# Altium project Keyboard2025.PrjPcb
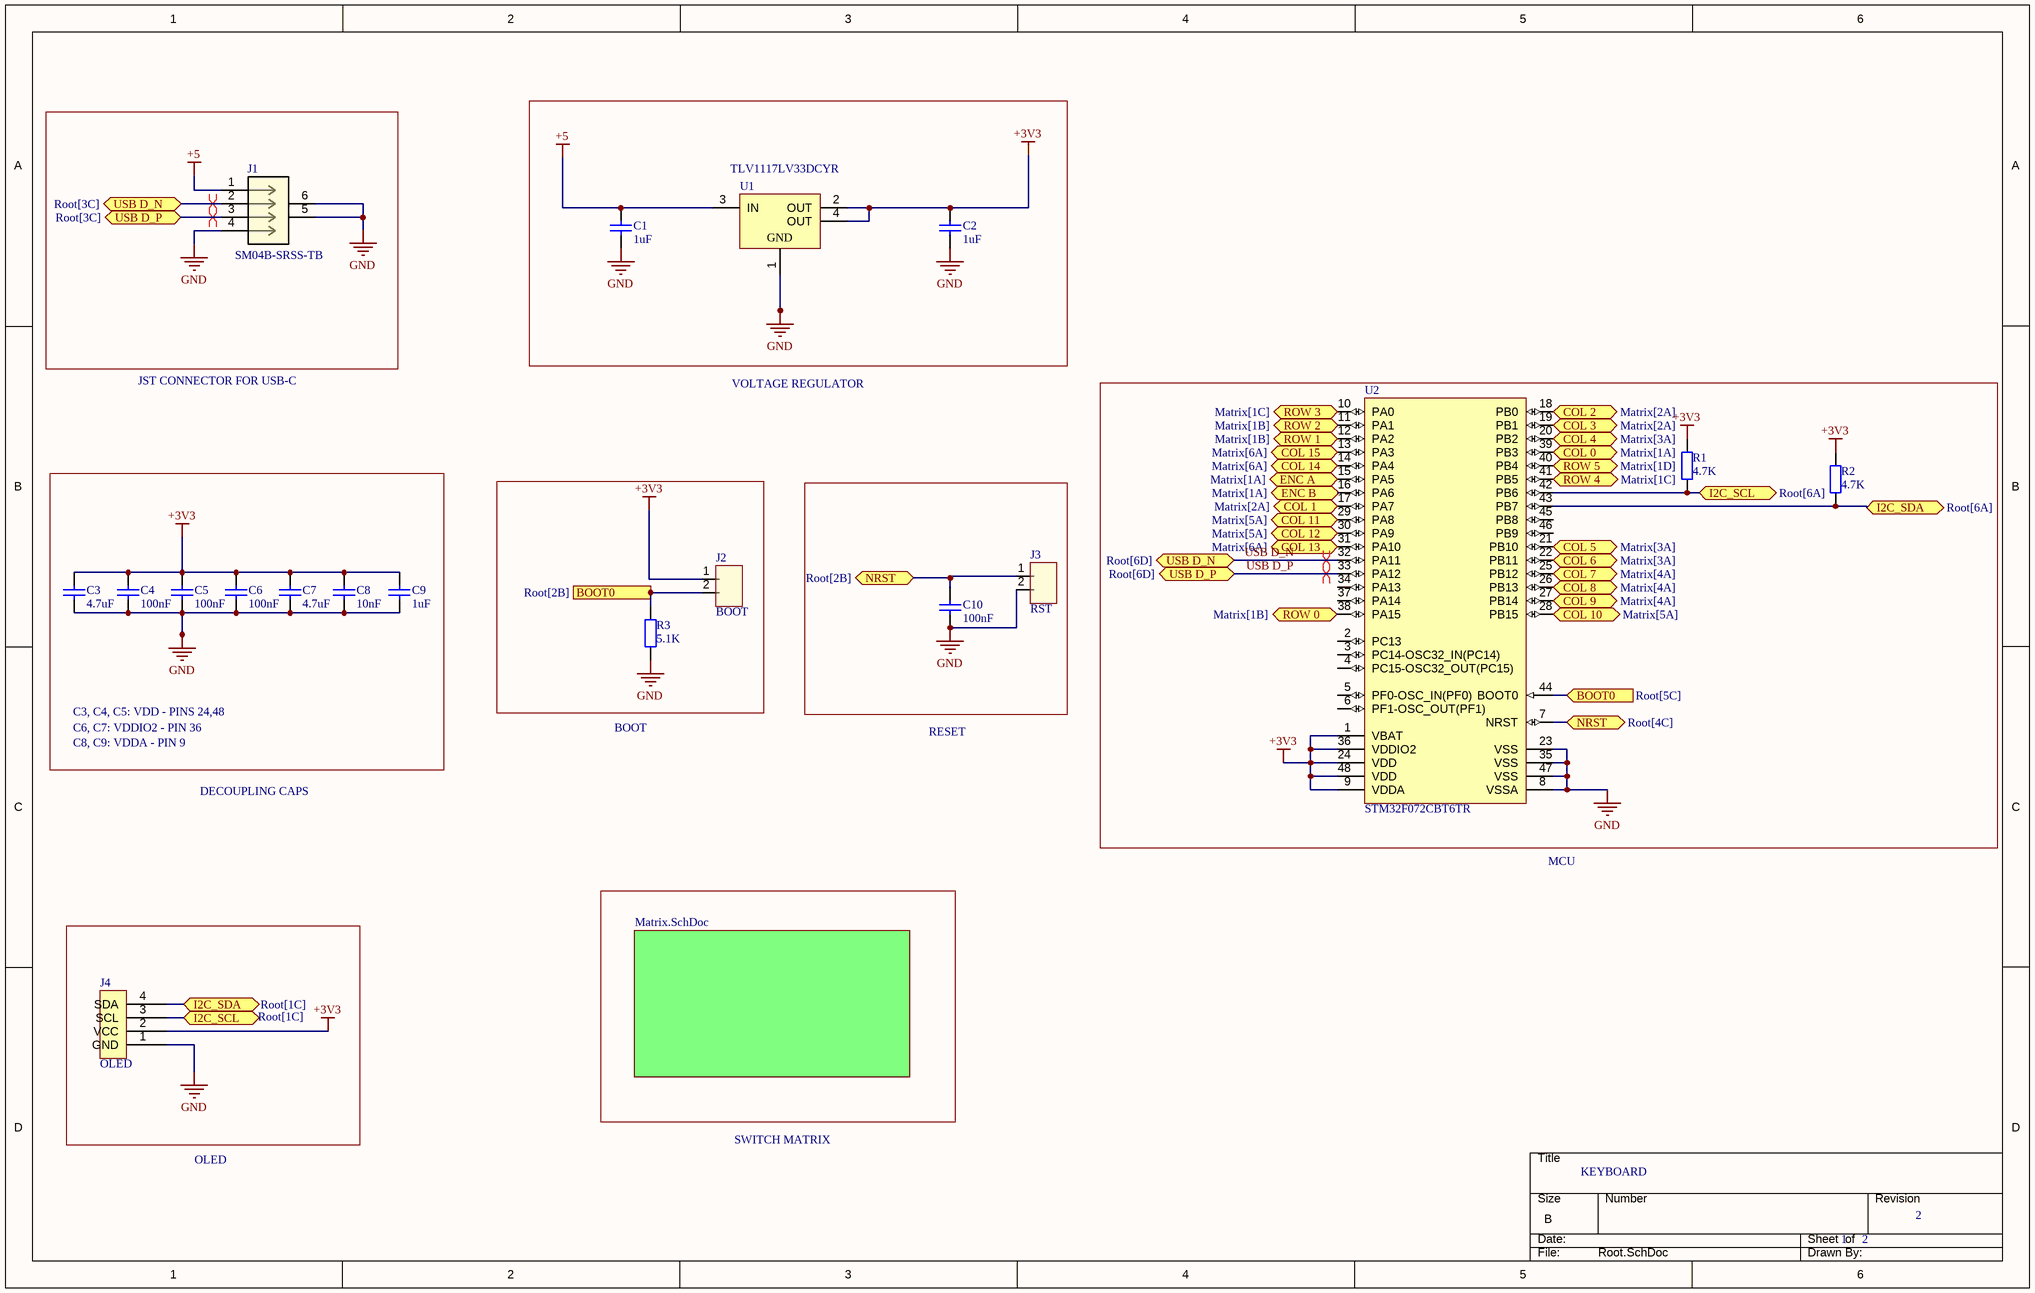
[diagram p0: Root.SchDoc]
2 sheets, 191 parts. Net scope: flat (ports and power ports of the same name join across sheets).
Board file: pcb.PcbDoc
Sheets:
  Root.SchDoc
    Matrix = Matrix.SchDoc

## Sheet Root.SchDoc
size B; SheetNumber: 1; SheetTotal: 2; SPICEModelCacheRYIKSWGO: <root> / <DocumentId>RYIKSWGO</DocumentId> / </root>

### Parts
C1  value 1uF  [C0805]  (hidden comment: Cap)
C2  value 1uF  [C0805]  (hidden comment: Cap)
C3  value 4.7uF  [C0805]  (hidden comment: Cap)
C4  value 100nF  [C0805]  (hidden comment: Cap)
C5  value 100nF  [C0805]  (hidden comment: Cap)
C6  value 100nF  [C0805]  (hidden comment: Cap)
C7  value 4.7uF  [C0805]  (hidden comment: Cap)
C8  value 10nF  [C0805]  (hidden comment: Cap)
C9  value 1uF  [C0805]  (hidden comment: Cap)
C10  value 100nF  [C0805]  (hidden comment: Cap)
J1  SM04B-SRSS-TB  [JST-SR-4]
J2  BOOT  [HDR_1X2]
J3  RST  [HDR_1X2]
J4  OLED  [SSD1306-0.91-OLED-4pin-128x32]
R1  value 4.7K  [6-0805_M]  (hidden comment: Res2)
R2  value 4.7K  [6-0805_M]  (hidden comment: Res2)
R3  value 5.1K  [6-0805_M]  (hidden comment: Res2)
U1  TLV1117LV33DCYR  [DCY0004A_M]
U2  STM32F072CBT6TR  [STM-LQFP48_M]

### Sub-sheets
Matrix = Matrix.SchDoc: no entries

### Ports
BOOT0 (in, see Root[5C]), BOOT0 (out, see Root[2B]), COL 0 (bidir, see Matrix[1A]), COL 1 (bidir, see Matrix[2A]), COL 2 (bidir, see Matrix[2A]), COL 3 (bidir, see Matrix[2A]), COL 4 (bidir, see Matrix[3A]), COL 5 (bidir, see Matrix[3A]), COL 6 (bidir, see Matrix[3A]), COL 7 (bidir, see Matrix[4A]), COL 8 (bidir, see Matrix[4A]), COL 9 (bidir, see Matrix[4A]), COL 10 (bidir, see Matrix[5A]), COL 11 (bidir, see Matrix[5A]), COL 12 (bidir, see Matrix[5A]), COL 13 (bidir, see Matrix[6A]), COL 14 (bidir, see Matrix[6A]), COL 15 (bidir, see Matrix[6A]), ENC A (bidir, see Matrix[1A]), ENC B (bidir, see Matrix[1A]), I2C_SCL (bidir, see Root[1C]), I2C_SCL (bidir, see Root[6A]), I2C_SDA (bidir, see Root[1C]), I2C_SDA (bidir, see Root[6A]), NRST (bidir, see Root[2B]), NRST (bidir, see Root[4C]), ROW 0 (bidir, see Matrix[1B]), ROW 1 (bidir, see Matrix[1B]), ROW 2 (bidir, see Matrix[1B]), ROW 3 (bidir, see Matrix[1C]), ROW 4 (bidir, see Matrix[1C]), ROW 5 (bidir, see Matrix[1D]), USB D_N (bidir, see Root[3C]), USB D_N (bidir, see Root[6D]), USB D_P (bidir, see Root[3C]), USB D_P (bidir, see Root[6D])

### Nets
+3V3: C2.2 C3.2 C4.2 C5.2 C6.2 C7.2 C8.2 C9.2 J2.1 J4.2(VCC) R1.2 R2.2 U1.2(OUT) U1.4(OUT) U2.1(VBAT) U2.9(VDDA) U2.24(VDD) U2.36(VDDIO2) U2.48(VDD)
+5: C1.2 J1.1 U1.3(IN)
GND: C1.1 C2.1 C3.1 C4.1 C5.1 C6.1 C7.1 C8.1 C9.1 C10.1 J1.4 J1.5(MOUNT) J1.6(MOUNT) J3.2 J4.1(GND) R3.1 U1.1(GND) U2.8(VSSA) U2.23(VSS) U2.35(VSS) U2.47(VSS)
USB D_N: J1.2 U2.32(PA11) ; port USB D_N
USB D_P: J1.3 U2.33(PA12) ; port USB D_P
NetC10_2: C10.2 J3.1 U2.7(NRST) ; port NRST
NetD1_2: U2.38(PA15) ; port ROW 0
NetD14_2: U2.12(PA2) ; port ROW 1
NetD30_2: U2.11(PA1) ; port ROW 2
NetD46_2: U2.10(PA0) ; port ROW 3
NetD61_2: U2.41(PB5) ; port ROW 4
NetD76_2: U2.40(PB4) ; port ROW 5
NetJ2_2: J2.2 R3.2 U2.44(BOOT0) ; port BOOT0
NetJ4_3: J4.3(SCL) R1.1 U2.42(PB6) ; port I2C_SCL
NetJ4_4: J4.4(SDA) R2.1 U2.43(PB7) ; port I2C_SDA
NetMX1_1: U2.17(PA7) ; port COL 1
NetMX2_1: U2.18(PB0) ; port COL 2
NetMX3_1: U2.19(PB1) ; port COL 3
NetMX4_1: U2.20(PB2) ; port COL 4
NetMX5_1: U2.21(PB10) ; port COL 5
NetMX6_1: U2.22(PB11) ; port COL 6
NetMX7_1: U2.25(PB12) ; port COL 7
NetMX8_1: U2.26(PB13) ; port COL 8
NetMX9_1: U2.27(PB14) ; port COL 9
NetMX10_1: U2.28(PB15) ; port COL 10
NetMX11_1: U2.29(PA8) ; port COL 11
NetMX12_1: U2.30(PA9) ; port COL 12
NetMX13_1: U2.31(PA10) ; port COL 13
NetMX14_1: U2.39(PB3) ; port COL 0
NetMX28_1: U2.14(PA4) ; port COL 14
NetMX29_1: U2.13(PA3) ; port COL 15
NetSW1_A: U2.15(PA5) ; port ENC A
NetSW1_B: U2.16(PA6) ; port ENC B

Not connected (* = marked no-connect by the designer): U2 2(PC13) 3(PC14-OSC32_IN(PC14)) 4(PC15-OSC32_OUT(PC15)) 5(PF0-OSC_IN(PF0)) 6(PF1-OSC_OUT(PF1)) 34(PA13) 37(PA14) 45(PB8) 46(PB9)

### Layout directives
differential pair: USB D_N, USB D_P

### Notes on the sheet
- JST CONNECTOR FOR USB-C
- VOLTAGE REGULATOR
- C3, C4, C5: VDD - PINS 24,48
- C6, C7: VDDIO2 - PIN 36
- C8, C9: VDDA - PIN 9
- BOOT
- RESET
- DECOUPLING CAPS
- MCU
- OLED
- SWITCH MATRIX
- KEYBOARD
- 1     2
- 2
- DWG. NO.
- REV.
- SHT.
- REVISION
- DESCRIPTION
- DATE
- APPROVED
- THIS DOCUMENT AND THE DATA DISCLOSED HEREIN OR HEREWITH IS THE PROPERTY OF ALTIUM LIMITED AND MAY BE FREELY DISTRIBUTED IN WHOLE. NO RIGHTS ARE RESERVED OR EXPRESS OR IMPLIED WARANTEE GIVEN.
- ENG:
- DSN:
- APPROVALS
- PROJECT
- DOCUMENT REVISION:
- DESIGN ITEM:
- CHK:
- BOM:
- REFERENCE DOCUMENTS
- PROJECT REVISION:
- TITLE
- FAB DWG:
- PCB DWG:
- ASSY DWG:
- SCALE:
- SIZE
- C
- CAGE CODE
- FILE NAME
- DWG NO.
- SHEET
- OF
- REV

### Library data of the parts
C1-C10 = Cap: Capacitor; Published: 8-Jun-2000; LatestRevisionDate: 17-Jul-2002; LatestRevisionNote: Re-released for DXP Platform.; PackageReference: RAD-0.3; Publisher: Altium Limited; PackageDescription: Radial Cap, Thru-Hole; 2 Leads; 0.3 in Pin Spacing
J1 = SM04B-SRSS-TB: No Description Available; Mfr_Name: JST; RefDes: RefDes; Type: Type
J2 J3 = CMP-002-00110-3: VALUE: HDRM2; Pins: 2; Design Item ID: HDR_1X2; Component Type: Standard; Source: Conn Header.SchLib
J4 = CMP-002-00072-5: 4 pin header
R1-R3 = Res2: Resistor; Published: 8-Jun-2000; LatestRevisionDate: 17-Jul-2002; LatestRevisionNote: Re-released for DXP Platform.; PackageReference: AXIAL-0.4; Publisher: Altium Limited; PackageDescription: Axial Device, Thru-Hole; 2 Leads; 0.4 in Pin Spacing
U1 = CMP-0395-00503-2: Single Output LDO, 1 A, Fixed 3.3 V Output, 2 to 5.5 V Input, 4-pin SOT-223 (DCY), -40 to 125 degC, Green (RoHS & no Sb/Br); Manufacturer: Texas Instruments; Vout Adj(Min)(V): 3.3; Vdo(Typ)(mV): 1200; Iq(Typ)(mA): 0.05; Accuracy(%): 2; Iout(Max)(A): 1; SubFamily: Single Channel LDO; Vin(Max)(V): 5.5; PackageReference: DCY0004A; PackageDescription: 4-Pin Plastic Small Outline, Body 3.5 x 6.5 mm, Pitch 2.3 mm; Vout Adj(Max)(V): 3.3; Mounting Technology: Surface Mount; ComponentLink2Description: Datasheet; ComponentLink1Description: Manufacturer URL; PartNumber: TLV1117LV33DCYR; ComponentLink3Description: Package Specification; ComponentLink1URL: http://www.ti.com/; ComponentLink2URL: http://www.ti.com/general/docs/lit/getliterature.tsp?genericPartNumber=TLV1117LV33&fileType=pdf; Fixed Output Options(V): 3.3; PackageVersion: 4202506/B; Vin(Min)(V): 2; DatasheetVersion: SBVS160A; Eco-Plan: Green (RoHS & no Sb/Br); ComponentLink3URL: http://www.ti.com/litv/pdf/mpds094a; Code_JEDEC: TO-261
U2 = CMP-0304-00171-1: ARM Cortex-M0 32-bit MCU, 128 KB Flash, 16 KB Internal RAM, 37 I/Os, 48-Pin LQFP, -40 to 85 degC, Tape and Reel; FLASH Size (Prog) (kB): 128; D/A Converter: 1; Operating Frequency(F) (Processor speed) (MHz): 48; Supply Voltage(Vcc) min (V): 2; I/Os (High Current): 37; Internal RAM Size (kB): 16; ComponentLink1URL: http://www.st.com/; DatasheetVersion: Rev. 5; Mounting Technology: Surface Mount; Packing: Tape and Reel; ComponentLink2Description: Datasheet; ComponentLink2URL: http://www.st.com/st-web-ui/static/active/en/resource/technical/document/datasheet/DM00090510.pdf; ComponentLink1Description: Manufacturer URL; Package Reference: LQFP48; Core: ARM Cortex-M0; Package Description: 48-Pin Low Profile Quad Flat Package, Body 7 x 7 mm, Pitch 0.5 mm

## Sheet Matrix.SchDoc
size B; SheetNumber: 2; SheetTotal: 2
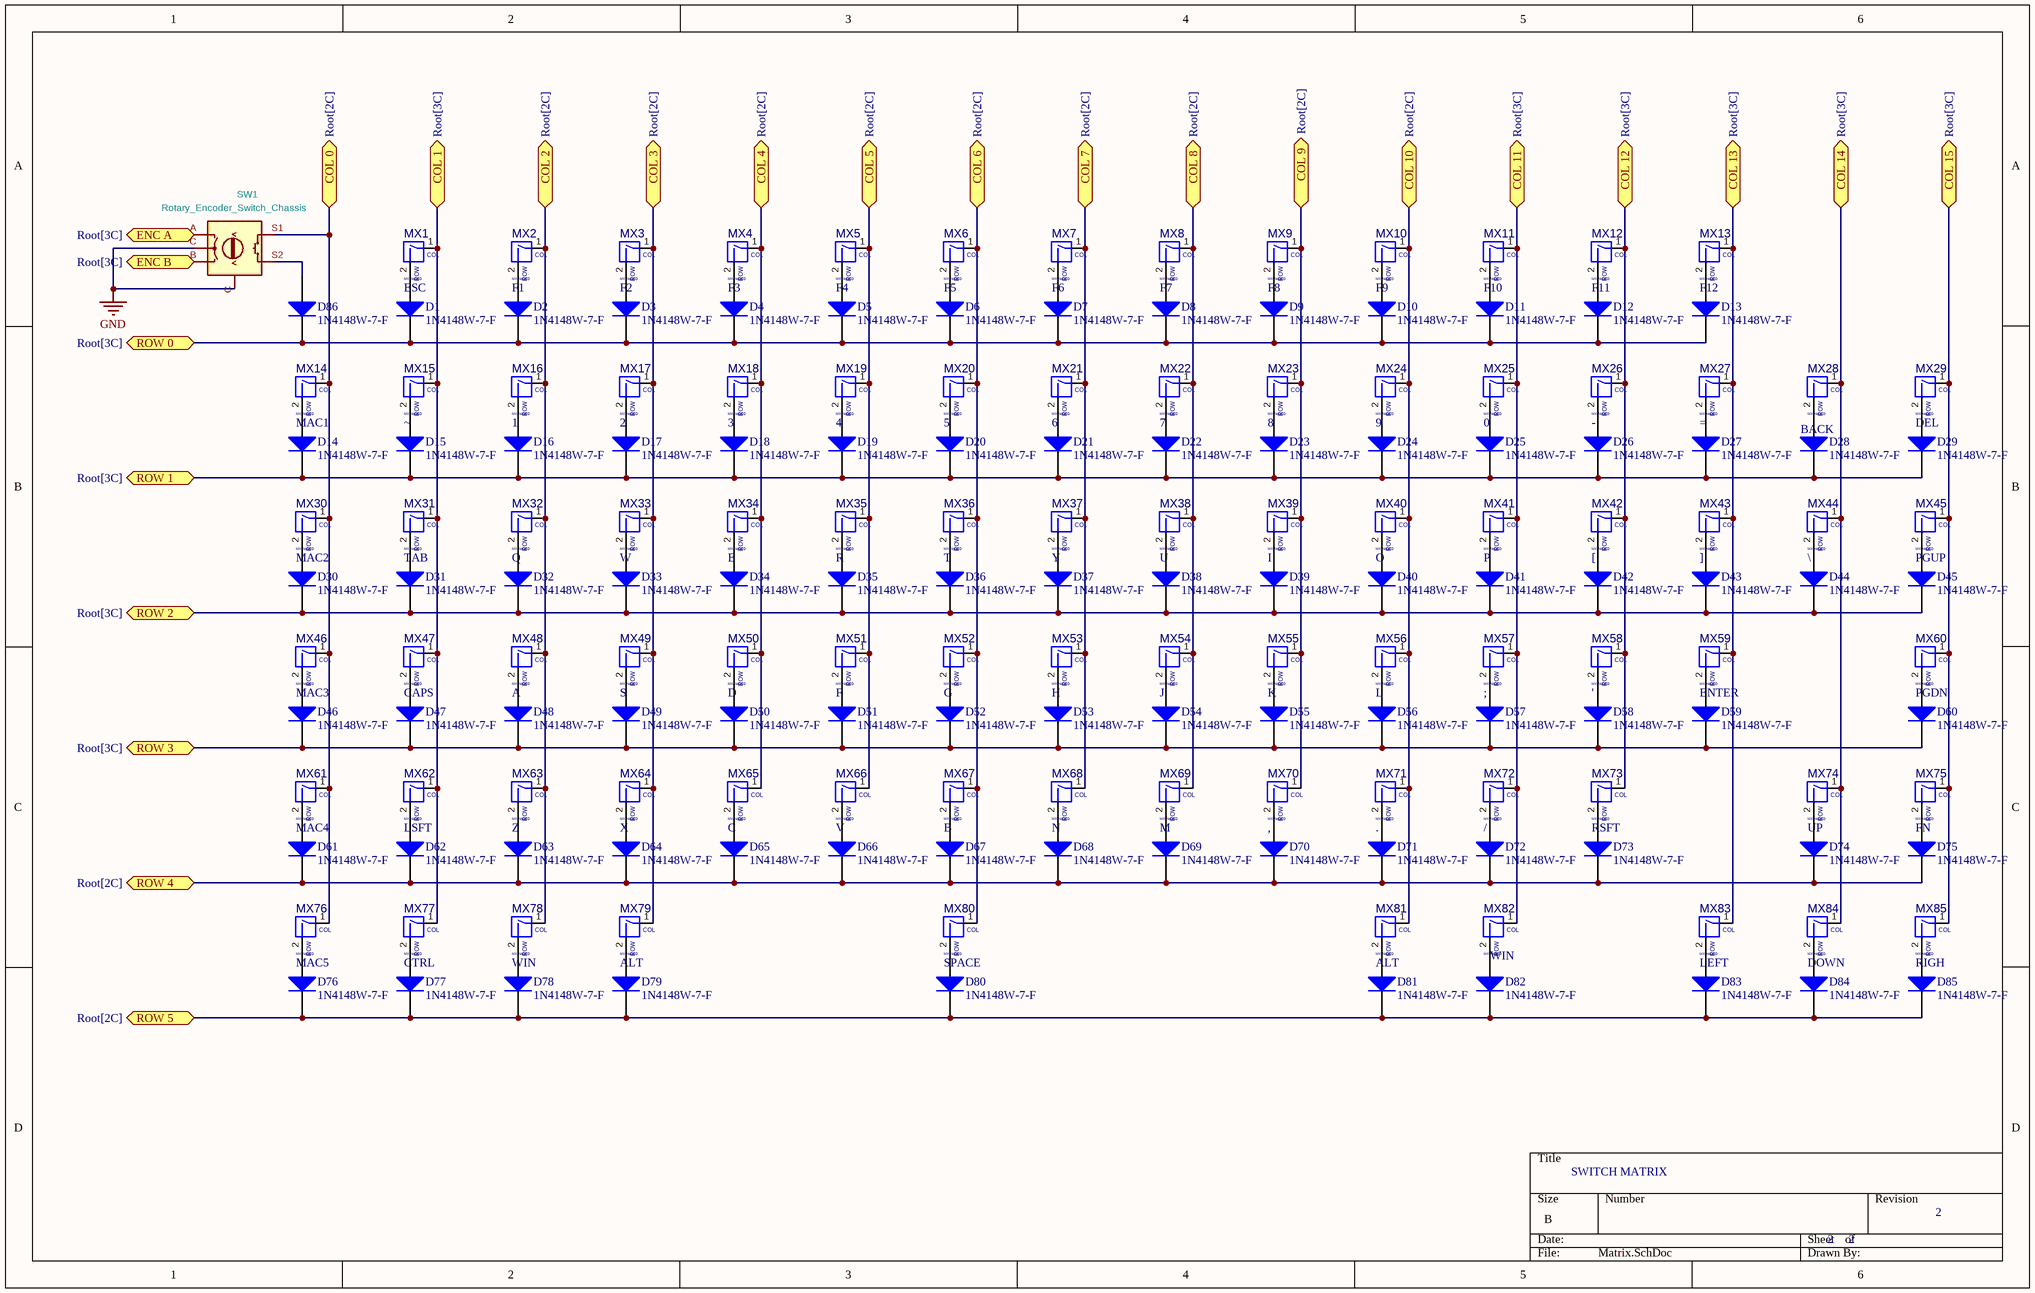
[diagram p1: Matrix.SchDoc]

### Parts
D1  1N4148W-7-F  [DIOD-SOD123-2_V]
D2  1N4148W-7-F  [DIOD-SOD123-2_V]
D3  1N4148W-7-F  [DIOD-SOD123-2_V]
D4  1N4148W-7-F  [DIOD-SOD123-2_V]
D5  1N4148W-7-F  [DIOD-SOD123-2_V]
D6  1N4148W-7-F  [DIOD-SOD123-2_V]
D7  1N4148W-7-F  [DIOD-SOD123-2_V]
D8  1N4148W-7-F  [DIOD-SOD123-2_V]
D9  1N4148W-7-F  [DIOD-SOD123-2_V]
D10  1N4148W-7-F  [DIOD-SOD123-2_V]
D11  1N4148W-7-F  [DIOD-SOD123-2_V]
D12  1N4148W-7-F  [DIOD-SOD123-2_V]
D13  1N4148W-7-F  [DIOD-SOD123-2_V]
D14  1N4148W-7-F  [DIOD-SOD123-2_V]
D15  1N4148W-7-F  [DIOD-SOD123-2_V]
D16  1N4148W-7-F  [DIOD-SOD123-2_V]
D17  1N4148W-7-F  [DIOD-SOD123-2_V]
D18  1N4148W-7-F  [DIOD-SOD123-2_V]
D19  1N4148W-7-F  [DIOD-SOD123-2_V]
D20  1N4148W-7-F  [DIOD-SOD123-2_V]
D21  1N4148W-7-F  [DIOD-SOD123-2_V]
D22  1N4148W-7-F  [DIOD-SOD123-2_V]
D23  1N4148W-7-F  [DIOD-SOD123-2_V]
D24  1N4148W-7-F  [DIOD-SOD123-2_V]
D25  1N4148W-7-F  [DIOD-SOD123-2_V]
D26  1N4148W-7-F  [DIOD-SOD123-2_V]
D27  1N4148W-7-F  [DIOD-SOD123-2_V]
D28  1N4148W-7-F  [DIOD-SOD123-2_V]
D29  1N4148W-7-F  [DIOD-SOD123-2_V]
D30  1N4148W-7-F  [DIOD-SOD123-2_V]
D31  1N4148W-7-F  [DIOD-SOD123-2_V]
D32  1N4148W-7-F  [DIOD-SOD123-2_V]
D33  1N4148W-7-F  [DIOD-SOD123-2_V]
D34  1N4148W-7-F  [DIOD-SOD123-2_V]
D35  1N4148W-7-F  [DIOD-SOD123-2_V]
D36  1N4148W-7-F  [DIOD-SOD123-2_V]
D37  1N4148W-7-F  [DIOD-SOD123-2_V]
D38  1N4148W-7-F  [DIOD-SOD123-2_V]
D39  1N4148W-7-F  [DIOD-SOD123-2_V]
D40  1N4148W-7-F  [DIOD-SOD123-2_V]
D41  1N4148W-7-F  [DIOD-SOD123-2_V]
D42  1N4148W-7-F  [DIOD-SOD123-2_V]
D43  1N4148W-7-F  [DIOD-SOD123-2_V]
D44  1N4148W-7-F  [DIOD-SOD123-2_V]
D45  1N4148W-7-F  [DIOD-SOD123-2_V]
D46  1N4148W-7-F  [DIOD-SOD123-2_V]
D47  1N4148W-7-F  [DIOD-SOD123-2_V]
D48  1N4148W-7-F  [DIOD-SOD123-2_V]
D49  1N4148W-7-F  [DIOD-SOD123-2_V]
D50  1N4148W-7-F  [DIOD-SOD123-2_V]
D51  1N4148W-7-F  [DIOD-SOD123-2_V]
D52  1N4148W-7-F  [DIOD-SOD123-2_V]
D53  1N4148W-7-F  [DIOD-SOD123-2_V]
D54  1N4148W-7-F  [DIOD-SOD123-2_V]
D55  1N4148W-7-F  [DIOD-SOD123-2_V]
D56  1N4148W-7-F  [DIOD-SOD123-2_V]
D57  1N4148W-7-F  [DIOD-SOD123-2_V]
D58  1N4148W-7-F  [DIOD-SOD123-2_V]
D59  1N4148W-7-F  [DIOD-SOD123-2_V]
D60  1N4148W-7-F  [DIOD-SOD123-2_V]
D61  1N4148W-7-F  [DIOD-SOD123-2_V]
D62  1N4148W-7-F  [DIOD-SOD123-2_V]
D63  1N4148W-7-F  [DIOD-SOD123-2_V]
D64  1N4148W-7-F  [DIOD-SOD123-2_V]
D65  1N4148W-7-F  [DIOD-SOD123-2_V]
D66  1N4148W-7-F  [DIOD-SOD123-2_V]
D67  1N4148W-7-F  [DIOD-SOD123-2_V]
D68  1N4148W-7-F  [DIOD-SOD123-2_V]
D69  1N4148W-7-F  [DIOD-SOD123-2_V]
D70  1N4148W-7-F  [DIOD-SOD123-2_V]
D71  1N4148W-7-F  [DIOD-SOD123-2_V]
D72  1N4148W-7-F  [DIOD-SOD123-2_V]
D73  1N4148W-7-F  [DIOD-SOD123-2_V]
D74  1N4148W-7-F  [DIOD-SOD123-2_V]
D75  1N4148W-7-F  [DIOD-SOD123-2_V]
D76  1N4148W-7-F  [DIOD-SOD123-2_V]
D77  1N4148W-7-F  [DIOD-SOD123-2_V]
D78  1N4148W-7-F  [DIOD-SOD123-2_V]
D79  1N4148W-7-F  [DIOD-SOD123-2_V]
D80  1N4148W-7-F  [DIOD-SOD123-2_V]
D81  1N4148W-7-F  [DIOD-SOD123-2_V]
D82  1N4148W-7-F  [DIOD-SOD123-2_V]
D83  1N4148W-7-F  [DIOD-SOD123-2_V]
D84  1N4148W-7-F  [DIOD-SOD123-2_V]
D85  1N4148W-7-F  [DIOD-SOD123-2_V]
D86  1N4148W-7-F  [DIOD-SOD123-2_V]
MX1  ESC  value MX-NoLED  [MXOnly-1U - duplicate]
MX2  F1  value MX-NoLED  [MXOnly-1U - duplicate]
MX3  F2  value MX-NoLED  [MXOnly-1U - duplicate]
MX4  F3  value MX-NoLED  [MXOnly-1U - duplicate]
MX5  F4  value MX-NoLED  [MXOnly-1U - duplicate]
MX6  F5  value MX-NoLED  [MXOnly-1U - duplicate]
MX7  F6  value MX-NoLED  [MXOnly-1U - duplicate]
MX8  F7  value MX-NoLED  [MXOnly-1U - duplicate]
MX9  F8  value MX-NoLED  [MXOnly-1U - duplicate]
MX10  F9  value MX-NoLED  [MXOnly-1U - duplicate]
MX11  F10  value MX-NoLED  [MXOnly-1U - duplicate]
MX12  F11  value MX-NoLED  [MXOnly-1U - duplicate]
MX13  F12  value MX-NoLED  [MXOnly-1U - duplicate]
MX14  MAC1  value MX-NoLED  [MXOnly-1U - duplicate]
MX15  ~  value MX-NoLED  [MXOnly-1U - duplicate]
MX16  1  value MX-NoLED  [MXOnly-1U - duplicate]
MX17  2  value MX-NoLED  [MXOnly-1U - duplicate]
MX18  3  value MX-NoLED  [MXOnly-1U - duplicate]
MX19  4  value MX-NoLED  [MXOnly-1U - duplicate]
MX20  5  value MX-NoLED  [MXOnly-1U - duplicate]
MX21  6  value MX-NoLED  [MXOnly-1U - duplicate]
MX22  7  value MX-NoLED  [MXOnly-1U - duplicate]
MX23  8  value MX-NoLED  [MXOnly-1U - duplicate]
MX24  9  value MX-NoLED  [MXOnly-1U - duplicate]
MX25  0  value MX-NoLED  [MXOnly-1U - duplicate]
MX26  -  value MX-NoLED  [MXOnly-1U - duplicate]
MX27  value MX-NoLED  [MXOnly-1U - duplicate]
MX28  BACK  value MX-NoLED  [MXOnly-2U - duplicate]
MX29  DEL  value MX-NoLED  [MXOnly-1U - duplicate]
MX30  MAC2  value MX-NoLED  [MXOnly-1U - duplicate]
MX31  TAB  value MX-NoLED  [MXOnly-1.5U - duplicate]
MX32  Q  value MX-NoLED  [MXOnly-1U - duplicate]
MX33  W  value MX-NoLED  [MXOnly-1U - duplicate]
MX34  E  value MX-NoLED  [MXOnly-1U - duplicate]
MX35  R  value MX-NoLED  [MXOnly-1U - duplicate]
MX36  T  value MX-NoLED  [MXOnly-1U - duplicate]
MX37  Y  value MX-NoLED  [MXOnly-1U - duplicate]
MX38  U  value MX-NoLED  [MXOnly-1U - duplicate]
MX39  I  value MX-NoLED  [MXOnly-1U - duplicate]
MX40  O  value MX-NoLED  [MXOnly-1U - duplicate]
MX41  P  value MX-NoLED  [MXOnly-1U - duplicate]
MX42  [  value MX-NoLED  [MXOnly-1U - duplicate]
MX43  ]  value MX-NoLED  [MXOnly-1U - duplicate]
MX44  \  value MX-NoLED  [MXOnly-1.5U - duplicate]
MX45  PGUP  value MX-NoLED  [MXOnly-1U - duplicate]
MX46  MAC3  value MX-NoLED  [MXOnly-1U - duplicate]
MX47  CAPS  value MX-NoLED  [MXOnly-1.75U - duplicate]
MX48  A  value MX-NoLED  [MXOnly-1U - duplicate]
MX49  S  value MX-NoLED  [MXOnly-1U - duplicate]
MX50  D  value MX-NoLED  [MXOnly-1U - duplicate]
MX51  F  value MX-NoLED  [MXOnly-1U - duplicate]
MX52  G  value MX-NoLED  [MXOnly-1U - duplicate]
MX53  H  value MX-NoLED  [MXOnly-1U - duplicate]
MX54  J  value MX-NoLED  [MXOnly-1U - duplicate]
MX55  K  value MX-NoLED  [MXOnly-1U - duplicate]
MX56  L  value MX-NoLED  [MXOnly-1U - duplicate]
MX57  ;  value MX-NoLED  [MXOnly-1U - duplicate]
MX58  '  value MX-NoLED  [MXOnly-1U - duplicate]
MX59  ENTER  value MX-NoLED  [MXOnly-2.25U - duplicate]
MX60  PGDN  value MX-NoLED  [MXOnly-1U - duplicate]
MX61  MAC4  value MX-NoLED  [MXOnly-1U - duplicate]
MX62  LSFT  value MX-NoLED  [MXOnly-2.25U - duplicate]
MX63  Z  value MX-NoLED  [MXOnly-1U - duplicate]
MX64  X  value MX-NoLED  [MXOnly-1U - duplicate]
MX65  C  value MX-NoLED  [MXOnly-1U - duplicate]
MX66  V  value MX-NoLED  [MXOnly-1U - duplicate]
MX67  B  value MX-NoLED  [MXOnly-1U - duplicate]
MX68  N  value MX-NoLED  [MXOnly-1U - duplicate]
MX69  M  value MX-NoLED  [MXOnly-1U - duplicate]
MX70  ,  value MX-NoLED  [MXOnly-1U - duplicate]
MX71  .  value MX-NoLED  [MXOnly-1U - duplicate]
MX72  /  value MX-NoLED  [MXOnly-1U - duplicate]
MX73  RSFT  value MX-NoLED  [MXOnly-1.75U - duplicate]
MX74  UP  value MX-NoLED  [MXOnly-1U - duplicate]
MX75  FN  value MX-NoLED  [MXOnly-1U - duplicate]
MX76  MAC5  value MX-NoLED  [MXOnly-1U - duplicate]
MX77  CTRL  value MX-NoLED  [MXOnly-1.25U - duplicate]
MX78  WIN  value MX-NoLED  [MXOnly-1.25U - duplicate]
MX79  ALT  value MX-NoLED  [MXOnly-1.25U - duplicate]
MX80  SPACE  value MX-NoLED  [MXOnly-6.25U-ReversedStabilizers - duplicate]
MX81  ALT  value MX-NoLED  [MXOnly-1.5U - duplicate]
MX82  WIN  value MX-NoLED  [MXOnly-1.5U - duplicate]
MX83  LEFT  value MX-NoLED  [MXOnly-1U - duplicate]
MX84  DOWN  value MX-NoLED  [MXOnly-1U - duplicate]
MX85  RIGH  value MX-NoLED  [MXOnly-1U - duplicate]
SW1  Rotary_Encoder_Switch_Chassis  [RotaryEncoder_Alps_EC11E-Switch_Vertical_H20mm]

### Ports
COL 0 (bidir, see Root[2C]), COL 1 (bidir, see Root[3C]), COL 2 (bidir, see Root[2C]), COL 3 (bidir, see Root[2C]), COL 4 (bidir, see Root[2C]), COL 5 (bidir, see Root[2C]), COL 6 (bidir, see Root[2C]), COL 7 (bidir, see Root[2C]), COL 8 (bidir, see Root[2C]), COL 9 (bidir, see Root[2C]), COL 10 (bidir, see Root[2C]), COL 11 (bidir, see Root[3C]), COL 12 (bidir, see Root[3C]), COL 13 (bidir, see Root[3C]), COL 14 (bidir, see Root[3C]), COL 15 (bidir, see Root[3C]), ENC A (bidir, see Root[3C]), ENC B (bidir, see Root[3C]), ROW 0 (bidir, see Root[3C]), ROW 1 (bidir, see Root[3C]), ROW 2 (bidir, see Root[3C]), ROW 3 (bidir, see Root[3C]), ROW 4 (bidir, see Root[2C]), ROW 5 (bidir, see Root[2C])

### Nets
GND: SW1.C(Shield)
NetD1_1: D1.1(A) MX1.2(ROW)
NetD1_2: D1.2(K) D2.2(K) D3.2(K) D4.2(K) D5.2(K) D6.2(K) D7.2(K) D8.2(K) D9.2(K) D10.2(K) D11.2(K) D12.2(K) D13.2(K) D86.2(K) ; port ROW 0
NetD2_1: D2.1(A) MX2.2(ROW)
NetD3_1: D3.1(A) MX3.2(ROW)
NetD4_1: D4.1(A) MX4.2(ROW)
NetD5_1: D5.1(A) MX5.2(ROW)
NetD6_1: D6.1(A) MX6.2(ROW)
NetD7_1: D7.1(A) MX7.2(ROW)
NetD8_1: D8.1(A) MX8.2(ROW)
NetD9_1: D9.1(A) MX9.2(ROW)
NetD10_1: D10.1(A) MX10.2(ROW)
NetD11_1: D11.1(A) MX11.2(ROW)
NetD12_1: D12.1(A) MX12.2(ROW)
NetD13_1: D13.1(A) MX13.2(ROW)
NetD14_1: D14.1(A) MX14.2(ROW)
NetD14_2: D14.2(K) D15.2(K) D16.2(K) D17.2(K) D18.2(K) D19.2(K) D20.2(K) D21.2(K) D22.2(K) D23.2(K) D24.2(K) D25.2(K) D26.2(K) D27.2(K) D28.2(K) D29.2(K) ; port ROW 1
NetD15_1: D15.1(A) MX15.2(ROW)
NetD16_1: D16.1(A) MX16.2(ROW)
NetD17_1: D17.1(A) MX17.2(ROW)
NetD18_1: D18.1(A) MX18.2(ROW)
NetD19_1: D19.1(A) MX19.2(ROW)
NetD20_1: D20.1(A) MX20.2(ROW)
NetD21_1: D21.1(A) MX21.2(ROW)
NetD22_1: D22.1(A) MX22.2(ROW)
NetD23_1: D23.1(A) MX23.2(ROW)
NetD24_1: D24.1(A) MX24.2(ROW)
NetD25_1: D25.1(A) MX25.2(ROW)
NetD26_1: D26.1(A) MX26.2(ROW)
NetD27_1: D27.1(A) MX27.2(ROW)
NetD28_1: D28.1(A) MX28.2(ROW)
NetD29_1: D29.1(A) MX29.2(ROW)
NetD30_1: D30.1(A) MX30.2(ROW)
NetD30_2: D30.2(K) D31.2(K) D32.2(K) D33.2(K) D34.2(K) D35.2(K) D36.2(K) D37.2(K) D38.2(K) D39.2(K) D40.2(K) D41.2(K) D42.2(K) D43.2(K) D44.2(K) D45.2(K) ; port ROW 2
NetD31_1: D31.1(A) MX31.2(ROW)
NetD32_1: D32.1(A) MX32.2(ROW)
NetD33_1: D33.1(A) MX33.2(ROW)
NetD34_1: D34.1(A) MX34.2(ROW)
NetD35_1: D35.1(A) MX35.2(ROW)
NetD36_1: D36.1(A) MX36.2(ROW)
NetD37_1: D37.1(A) MX37.2(ROW)
NetD38_1: D38.1(A) MX38.2(ROW)
NetD39_1: D39.1(A) MX39.2(ROW)
NetD40_1: D40.1(A) MX40.2(ROW)
NetD41_1: D41.1(A) MX41.2(ROW)
NetD42_1: D42.1(A) MX42.2(ROW)
NetD43_1: D43.1(A) MX43.2(ROW)
NetD44_1: D44.1(A) MX44.2(ROW)
NetD45_1: D45.1(A) MX45.2(ROW)
NetD46_1: D46.1(A) MX46.2(ROW)
NetD46_2: D46.2(K) D47.2(K) D48.2(K) D49.2(K) D50.2(K) D51.2(K) D52.2(K) D53.2(K) D54.2(K) D55.2(K) D56.2(K) D57.2(K) D58.2(K) D59.2(K) D60.2(K) ; port ROW 3
NetD47_1: D47.1(A) MX47.2(ROW)
NetD48_1: D48.1(A) MX48.2(ROW)
NetD49_1: D49.1(A) MX49.2(ROW)
NetD50_1: D50.1(A) MX50.2(ROW)
NetD51_1: D51.1(A) MX51.2(ROW)
NetD52_1: D52.1(A) MX52.2(ROW)
NetD53_1: D53.1(A) MX53.2(ROW)
NetD54_1: D54.1(A) MX54.2(ROW)
NetD55_1: D55.1(A) MX55.2(ROW)
NetD56_1: D56.1(A) MX56.2(ROW)
NetD57_1: D57.1(A) MX57.2(ROW)
NetD58_1: D58.1(A) MX58.2(ROW)
NetD59_1: D59.1(A) MX59.2(ROW)
NetD60_1: D60.1(A) MX60.2(ROW)
NetD61_1: D61.1(A) MX61.2(ROW)
NetD61_2: D61.2(K) D62.2(K) D63.2(K) D64.2(K) D65.2(K) D66.2(K) D67.2(K) D68.2(K) D69.2(K) D70.2(K) D71.2(K) D72.2(K) D73.2(K) D74.2(K) D75.2(K) ; port ROW 4
NetD62_1: D62.1(A) MX62.2(ROW)
NetD63_1: D63.1(A) MX63.2(ROW)
NetD64_1: D64.1(A) MX64.2(ROW)
NetD65_1: D65.1(A) MX65.2(ROW)
NetD66_1: D66.1(A) MX66.2(ROW)
NetD67_1: D67.1(A) MX67.2(ROW)
NetD68_1: D68.1(A) MX68.2(ROW)
NetD69_1: D69.1(A) MX69.2(ROW)
NetD70_1: D70.1(A) MX70.2(ROW)
NetD71_1: D71.1(A) MX71.2(ROW)
NetD72_1: D72.1(A) MX72.2(ROW)
NetD73_1: D73.1(A) MX73.2(ROW)
NetD74_1: D74.1(A) MX74.2(ROW)
NetD75_1: D75.1(A) MX75.2(ROW)
NetD76_1: D76.1(A) MX76.2(ROW)
NetD76_2: D76.2(K) D77.2(K) D78.2(K) D79.2(K) D80.2(K) D81.2(K) D82.2(K) D83.2(K) D84.2(K) D85.2(K) ; port ROW 5
NetD77_1: D77.1(A) MX77.2(ROW)
NetD78_1: D78.1(A) MX78.2(ROW)
NetD79_1: D79.1(A) MX79.2(ROW)
NetD80_1: D80.1(A) MX80.2(ROW)
NetD81_1: D81.1(A) MX81.2(ROW)
NetD82_1: D82.1(A) MX82.2(ROW)
NetD83_1: D83.1(A) MX83.2(ROW)
NetD84_1: D84.1(A) MX84.2(ROW)
NetD85_1: D85.1(A) MX85.2(ROW)
NetD86_1: D86.1(A) SW1.S2
NetMX1_1: MX1.1(COL) MX15.1(COL) MX31.1(COL) MX47.1(COL) MX62.1(COL) MX77.1(COL) ; port COL 1
NetMX2_1: MX2.1(COL) MX16.1(COL) MX32.1(COL) MX48.1(COL) MX63.1(COL) MX78.1(COL) ; port COL 2
NetMX3_1: MX3.1(COL) MX17.1(COL) MX33.1(COL) MX49.1(COL) MX64.1(COL) MX79.1(COL) ; port COL 3
NetMX4_1: MX4.1(COL) MX18.1(COL) MX34.1(COL) MX50.1(COL) MX65.1(COL) ; port COL 4
NetMX5_1: MX5.1(COL) MX19.1(COL) MX35.1(COL) MX51.1(COL) MX66.1(COL) ; port COL 5
NetMX6_1: MX6.1(COL) MX20.1(COL) MX36.1(COL) MX52.1(COL) MX67.1(COL) MX80.1(COL) ; port COL 6
NetMX7_1: MX7.1(COL) MX21.1(COL) MX37.1(COL) MX53.1(COL) MX68.1(COL) ; port COL 7
NetMX8_1: MX8.1(COL) MX22.1(COL) MX38.1(COL) MX54.1(COL) MX69.1(COL) ; port COL 8
NetMX9_1: MX9.1(COL) MX23.1(COL) MX39.1(COL) MX55.1(COL) MX70.1(COL) ; port COL 9
NetMX10_1: MX10.1(COL) MX24.1(COL) MX40.1(COL) MX56.1(COL) MX71.1(COL) MX81.1(COL) ; port COL 10
NetMX11_1: MX11.1(COL) MX25.1(COL) MX41.1(COL) MX57.1(COL) MX72.1(COL) MX82.1(COL) ; port COL 11
NetMX12_1: MX12.1(COL) MX26.1(COL) MX42.1(COL) MX58.1(COL) MX73.1(COL) ; port COL 12
NetMX13_1: MX13.1(COL) MX27.1(COL) MX43.1(COL) MX59.1(COL) MX83.1(COL) ; port COL 13
NetMX14_1: MX14.1(COL) MX30.1(COL) MX46.1(COL) MX61.1(COL) MX76.1(COL) SW1.S1 ; port COL 0
NetMX28_1: MX28.1(COL) MX44.1(COL) MX74.1(COL) MX84.1(COL) ; port COL 14
NetMX29_1: MX29.1(COL) MX45.1(COL) MX60.1(COL) MX75.1(COL) MX85.1(COL) ; port COL 15
NetSW1_A: SW1.A ; port ENC A
NetSW1_B: SW1.B ; port ENC B

### Notes on the sheet
- SWITCH MATRIX
- 2     2
- 2

### Library data of the parts
D1-D86 = CMP-004-00033-1: Rectifier Diode, 1 Phase, 1 Element, 0.15A, 100V V(RRM), Silicon; Forward Voltage: 715mV; Non-rep Pk Forward Current-Max: 1A; Number of Elements: 1; Time @ Peak Reflow Temperature-Max (s): 40s; Reverse Recovery Time-Max: 0.004us; Qualification Status: Not Qualified; Max Output current: 150mA; Max Power Dissipation: 400mW; Additional Feature: HIGH RELIABILITY; Package Body Material: Plastic; Min Operating Temperature: -65°C; Pins: 2; Max Operating Temperature: 150°C; RoHS Compliant: Yes; Diode Type: RECTIFIER; Peak Reflow Temperature (Cel): 260°C; Package Shape: Rectangular; Terminal Finish: Tin; Moisture Sensitivity Level: 1; Surface Mount: Yes; Reach SVHC Compliant: Yes; Diode Element Material: SILICON; JESD-30 Code: R-PDSO-G2; Terminal Form: Gull Wing; Rep Pk Reverse Voltage-Max: 100V; Terminal Position: DUAL; JESD-609 Code: e3; Package Style: SMALL OUTLINEMeter
MX1-MX85 = MX-NoLED
SW1 = Rotary_Encoder_Switch_Chassis: Value: Rotary_Encoder_Switch_Chassis; Footprint: acheronHardware:ALPS_EC11E

## Nets that join several sheets
GND: Root (21 pins), Matrix (SW1.C)
NetD1_2: Root (U2.38), Matrix (14 pins)
NetD14_2: Root (U2.12), Matrix (16 pins)
NetD30_2: Root (U2.11), Matrix (16 pins)
NetD46_2: Root (U2.10), Matrix (15 pins)
NetD61_2: Root (U2.41), Matrix (15 pins)
NetD76_2: Root (U2.40), Matrix (10 pins)
NetMX1_1: Root (U2.17), Matrix (6 pins)
NetMX2_1: Root (U2.18), Matrix (6 pins)
NetMX3_1: Root (U2.19), Matrix (6 pins)
NetMX4_1: Root (U2.20), Matrix (5 pins)
NetMX5_1: Root (U2.21), Matrix (5 pins)
NetMX6_1: Root (U2.22), Matrix (6 pins)
NetMX7_1: Root (U2.25), Matrix (5 pins)
NetMX8_1: Root (U2.26), Matrix (5 pins)
NetMX9_1: Root (U2.27), Matrix (5 pins)
NetMX10_1: Root (U2.28), Matrix (6 pins)
NetMX11_1: Root (U2.29), Matrix (6 pins)
NetMX12_1: Root (U2.30), Matrix (5 pins)
NetMX13_1: Root (U2.31), Matrix (5 pins)
NetMX14_1: Root (U2.39), Matrix (6 pins)
NetMX28_1: Root (U2.14), Matrix (MX28.1 MX44.1 MX74.1 MX84.1)
NetMX29_1: Root (U2.13), Matrix (5 pins)
NetSW1_A: Root (U2.15), Matrix (SW1.A)
NetSW1_B: Root (U2.16), Matrix (SW1.B)